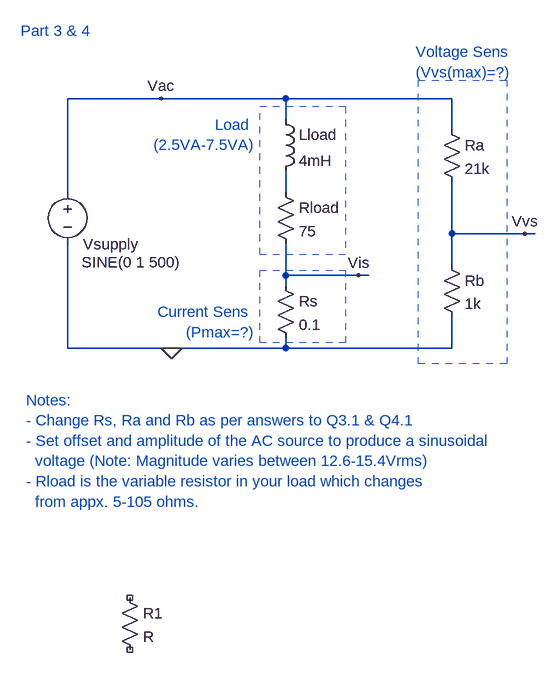
[diagram p0: schematic FinalAnalogDesign.asc]
FinalAnalogDesign.asc, the LTspice schematic file:
Version 4.1
SHEET 1 1984 2980
WIRE 624 944 480 944
WIRE 816 944 624 944
WIRE 1072 944 816 944
WIRE 816 976 816 944
WIRE 1072 992 1072 944
WIRE 480 1088 480 944
WIRE 816 1088 816 1056
WIRE 1072 1152 1072 1072
WIRE 1184 1152 1072 1152
WIRE 1200 1152 1184 1152
WIRE 1072 1200 1072 1152
WIRE 816 1216 816 1168
WIRE 928 1216 816 1216
WIRE 944 1216 928 1216
WIRE 816 1232 816 1216
WIRE 480 1328 480 1168
WIRE 640 1328 480 1328
WIRE 816 1328 816 1312
WIRE 816 1328 640 1328
WIRE 1072 1328 1072 1280
WIRE 1072 1328 816 1328
FLAG 640 1328 0
FLAG 624 944 Vac
FLAG 928 1216 Vis
FLAG 1184 1152 Vvs
SYMBOL voltage 480 1072 R0
WINDOW 0 24 96 Left 2
WINDOW 3 22 124 Left 2
WINDOW 123 0 0 Left 0
WINDOW 39 0 0 Left 0
SYMATTR InstName Vsupply
SYMATTR Value SINE(0 1 500)
SYMBOL res 800 1072 R0
SYMATTR InstName Rload
SYMATTR Value 75
SYMBOL ind 800 960 R0
SYMATTR InstName Lload
SYMATTR Value 4mH
SYMBOL res 800 1216 R0
SYMATTR InstName Rs
SYMATTR Value 0.1
SYMBOL res 1056 976 R0
SYMATTR InstName Ra
SYMATTR Value 21k
SYMBOL res 1056 1184 R0
SYMATTR InstName Rb
SYMATTR Value 1k
SYMBOL res 560 1696 R0
SYMATTR InstName R1
TEXT 408 840 Left 2 ;Part 3 & 4
TEXT 416 1408 Left 2 ;Notes: \n- Change Rs, Ra and Rb as per answers to Q3.1 & Q4.1\n- Set offset and amplitude of the AC source to produce a sinusoidal\n  voltage (Note: Magnitude varies between 12.6-15.4Vrms)\n- Rload is the variable resistor in your load which changes \n  from appx. 5-105 ohms.
TEXT 768 984 Right 2 ;Load \n(2.5VA-7.5VA)
TEXT 768 1272 Right 2 ;Current Sens \n(Pmax=?)
TEXT 1016 872 Left 2 ;Voltage Sens\n(Vvs(max)=?)
RECTANGLE Normal 1020 916 1156 1352 2
RECTANGLE Normal 776 956 908 1184 2
RECTANGLE Normal 776 1208 908 1320 2

The netlist it stands for:
* FinalAnalogDesign.asc
Vsupply Vac 0 SINE(0 1 500)
Rload N001 Vis 75
Lload Vac N001 4mH
Rs Vis 0 0.1
Ra Vac Vvs 21k
Rb Vvs 0 1k
R1 NC_01 NC_02 R
* Part 3 & 4
* Notes:
* - Change Rs, Ra and Rb as per answers to Q3.1 & Q4.1
* - Set offset and amplitude of the AC source to produce a sinusoidal
*   voltage (Note: Magnitude varies between 12.6-15.4Vrms)
* - Rload is the variable resistor in your load which changes
*   from appx. 5-105 ohms.
* Load
* (2.5VA-7.5VA)
* Current Sens
* (Pmax=?)
* Voltage Sens
* (Vvs(max)=?)
.backanno
.end